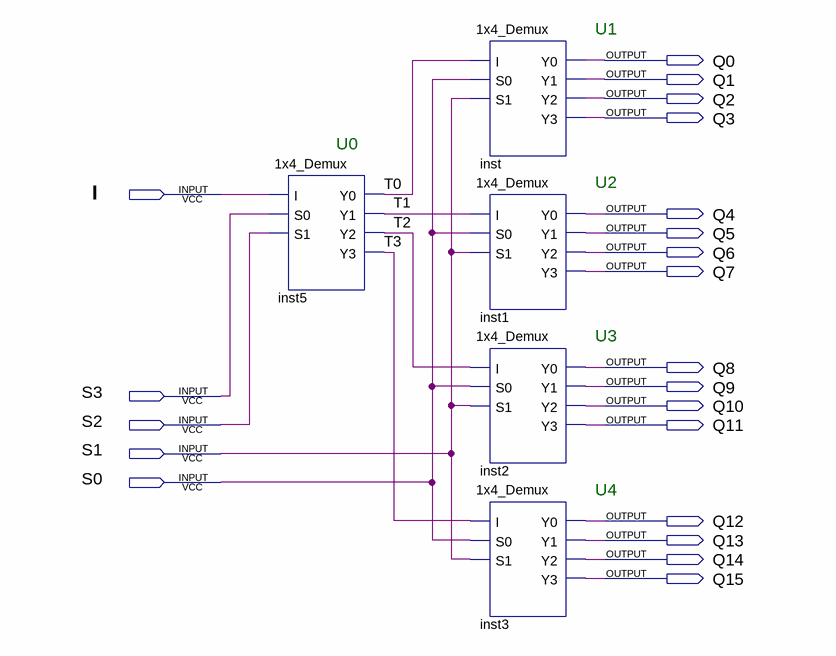
[diagram p0: schematic sheet]
// Quartus schematic 1x16_Demux_S.bdf as structural Verilog: 5 symbols, 21 pins
module \1x16_Demux_S  (
  input  I,
  input  S3,
  input  S2,
  input  S1,
  input  S0,
  output Q0,
  output Q1,
  output Q2,
  output Q3,
  output Q4,
  output Q5,
  output Q6,
  output Q7,
  output Q8,
  output Q9,
  output Q10,
  output Q11,
  output Q12,
  output Q13,
  output Q14,
  output Q15
);

  wire T0, T1, T2, T3;

  \1x4_Demux  inst5 (.I(I), .S0(S3), .S1(S2), .Y0(T0), .Y1(T1), .Y2(T2), .Y3(T3));
  \1x4_Demux  inst (.I(T0), .S0(S0), .S1(S1), .Y0(Q0), .Y1(Q1), .Y2(Q2), .Y3(Q3));
  \1x4_Demux  inst1 (.I(T1), .S0(S0), .S1(S1), .Y0(Q4), .Y1(Q5), .Y2(Q6), .Y3(Q7));
  \1x4_Demux  inst2 (.I(T2), .S0(S0), .S1(S1), .Y0(Q8), .Y1(Q9), .Y2(Q10), .Y3(Q11));
  \1x4_Demux  inst3 (.I(T3), .S0(S0), .S1(S1), .Y0(Q12), .Y1(Q13), .Y2(Q14), .Y3(Q15));

  // Notes on the sheet:
  //   U1
  //   U0
  //   U2
  //   U3
  //   U4
endmodule
